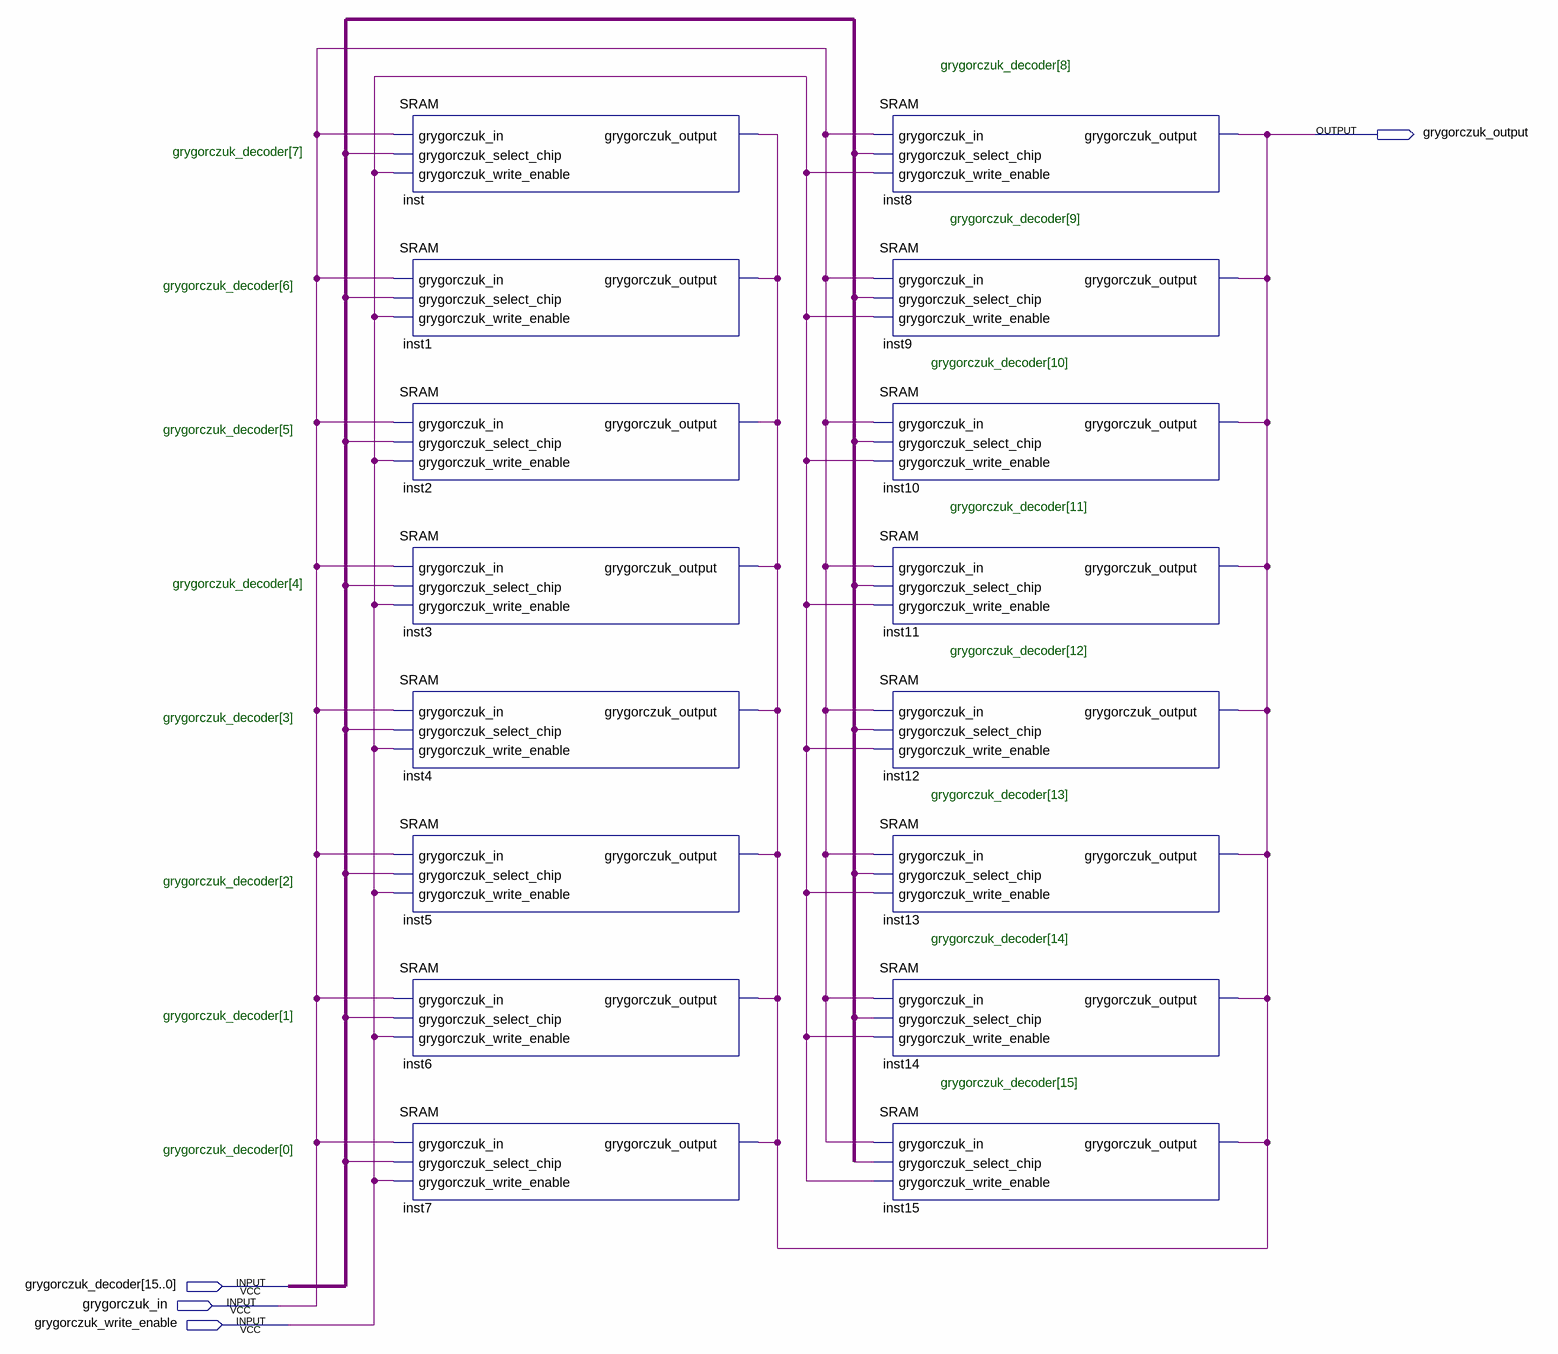
[diagram p0: schematic sheet]
// Quartus schematic SRAM_SIXTEEN_BY_FOUR.bdf as structural Verilog: 16 symbols, 4 pins
module SRAM_SIXTEEN_BY_FOUR (
  input  [15:0] grygorczuk_decoder,
  input  grygorczuk_in,
  input  grygorczuk_write_enable,
  output grygorczuk_output
);

  SRAM inst (
    .grygorczuk_in(grygorczuk_in), .grygorczuk_select_chip(grygorczuk_decoder[7]),
    .grygorczuk_write_enable(grygorczuk_write_enable), .grygorczuk_output(grygorczuk_output));
  SRAM inst1 (
    .grygorczuk_in(grygorczuk_in), .grygorczuk_select_chip(grygorczuk_decoder[6]),
    .grygorczuk_write_enable(grygorczuk_write_enable), .grygorczuk_output(grygorczuk_output));
  SRAM inst2 (
    .grygorczuk_in(grygorczuk_in), .grygorczuk_select_chip(grygorczuk_decoder[5]),
    .grygorczuk_write_enable(grygorczuk_write_enable), .grygorczuk_output(grygorczuk_output));
  SRAM inst3 (
    .grygorczuk_in(grygorczuk_in), .grygorczuk_select_chip(grygorczuk_decoder[4]),
    .grygorczuk_write_enable(grygorczuk_write_enable), .grygorczuk_output(grygorczuk_output));
  SRAM inst4 (
    .grygorczuk_in(grygorczuk_in), .grygorczuk_select_chip(grygorczuk_decoder[3]),
    .grygorczuk_write_enable(grygorczuk_write_enable), .grygorczuk_output(grygorczuk_output));
  SRAM inst5 (
    .grygorczuk_in(grygorczuk_in), .grygorczuk_select_chip(grygorczuk_decoder[2]),
    .grygorczuk_write_enable(grygorczuk_write_enable), .grygorczuk_output(grygorczuk_output));
  SRAM inst6 (
    .grygorczuk_in(grygorczuk_in), .grygorczuk_select_chip(grygorczuk_decoder[1]),
    .grygorczuk_write_enable(grygorczuk_write_enable), .grygorczuk_output(grygorczuk_output));
  SRAM inst7 (
    .grygorczuk_in(grygorczuk_in), .grygorczuk_select_chip(grygorczuk_decoder[0]),
    .grygorczuk_write_enable(grygorczuk_write_enable), .grygorczuk_output(grygorczuk_output));
  SRAM inst8 (
    .grygorczuk_in(grygorczuk_in), .grygorczuk_select_chip(grygorczuk_decoder[8]),
    .grygorczuk_write_enable(grygorczuk_write_enable), .grygorczuk_output(grygorczuk_output));
  SRAM inst9 (
    .grygorczuk_in(grygorczuk_in), .grygorczuk_select_chip(grygorczuk_decoder[9]),
    .grygorczuk_write_enable(grygorczuk_write_enable), .grygorczuk_output(grygorczuk_output));
  SRAM inst10 (
    .grygorczuk_in(grygorczuk_in), .grygorczuk_select_chip(grygorczuk_decoder[10]),
    .grygorczuk_write_enable(grygorczuk_write_enable), .grygorczuk_output(grygorczuk_output));
  SRAM inst11 (
    .grygorczuk_in(grygorczuk_in), .grygorczuk_select_chip(grygorczuk_decoder[11]),
    .grygorczuk_write_enable(grygorczuk_write_enable), .grygorczuk_output(grygorczuk_output));
  SRAM inst12 (
    .grygorczuk_in(grygorczuk_in), .grygorczuk_select_chip(grygorczuk_decoder[12]),
    .grygorczuk_write_enable(grygorczuk_write_enable), .grygorczuk_output(grygorczuk_output));
  SRAM inst13 (
    .grygorczuk_in(grygorczuk_in), .grygorczuk_select_chip(grygorczuk_decoder[13]),
    .grygorczuk_write_enable(grygorczuk_write_enable), .grygorczuk_output(grygorczuk_output));
  SRAM inst14 (
    .grygorczuk_in(grygorczuk_in), .grygorczuk_select_chip(grygorczuk_decoder[14]),
    .grygorczuk_write_enable(grygorczuk_write_enable), .grygorczuk_output(grygorczuk_output));
  SRAM inst15 (
    .grygorczuk_in(grygorczuk_in), .grygorczuk_select_chip(grygorczuk_decoder[15]),
    .grygorczuk_write_enable(grygorczuk_write_enable), .grygorczuk_output(grygorczuk_output));
endmodule
